# EAGLE design Reverse Geocache schematic v0.0 (EAGLE 5.11)
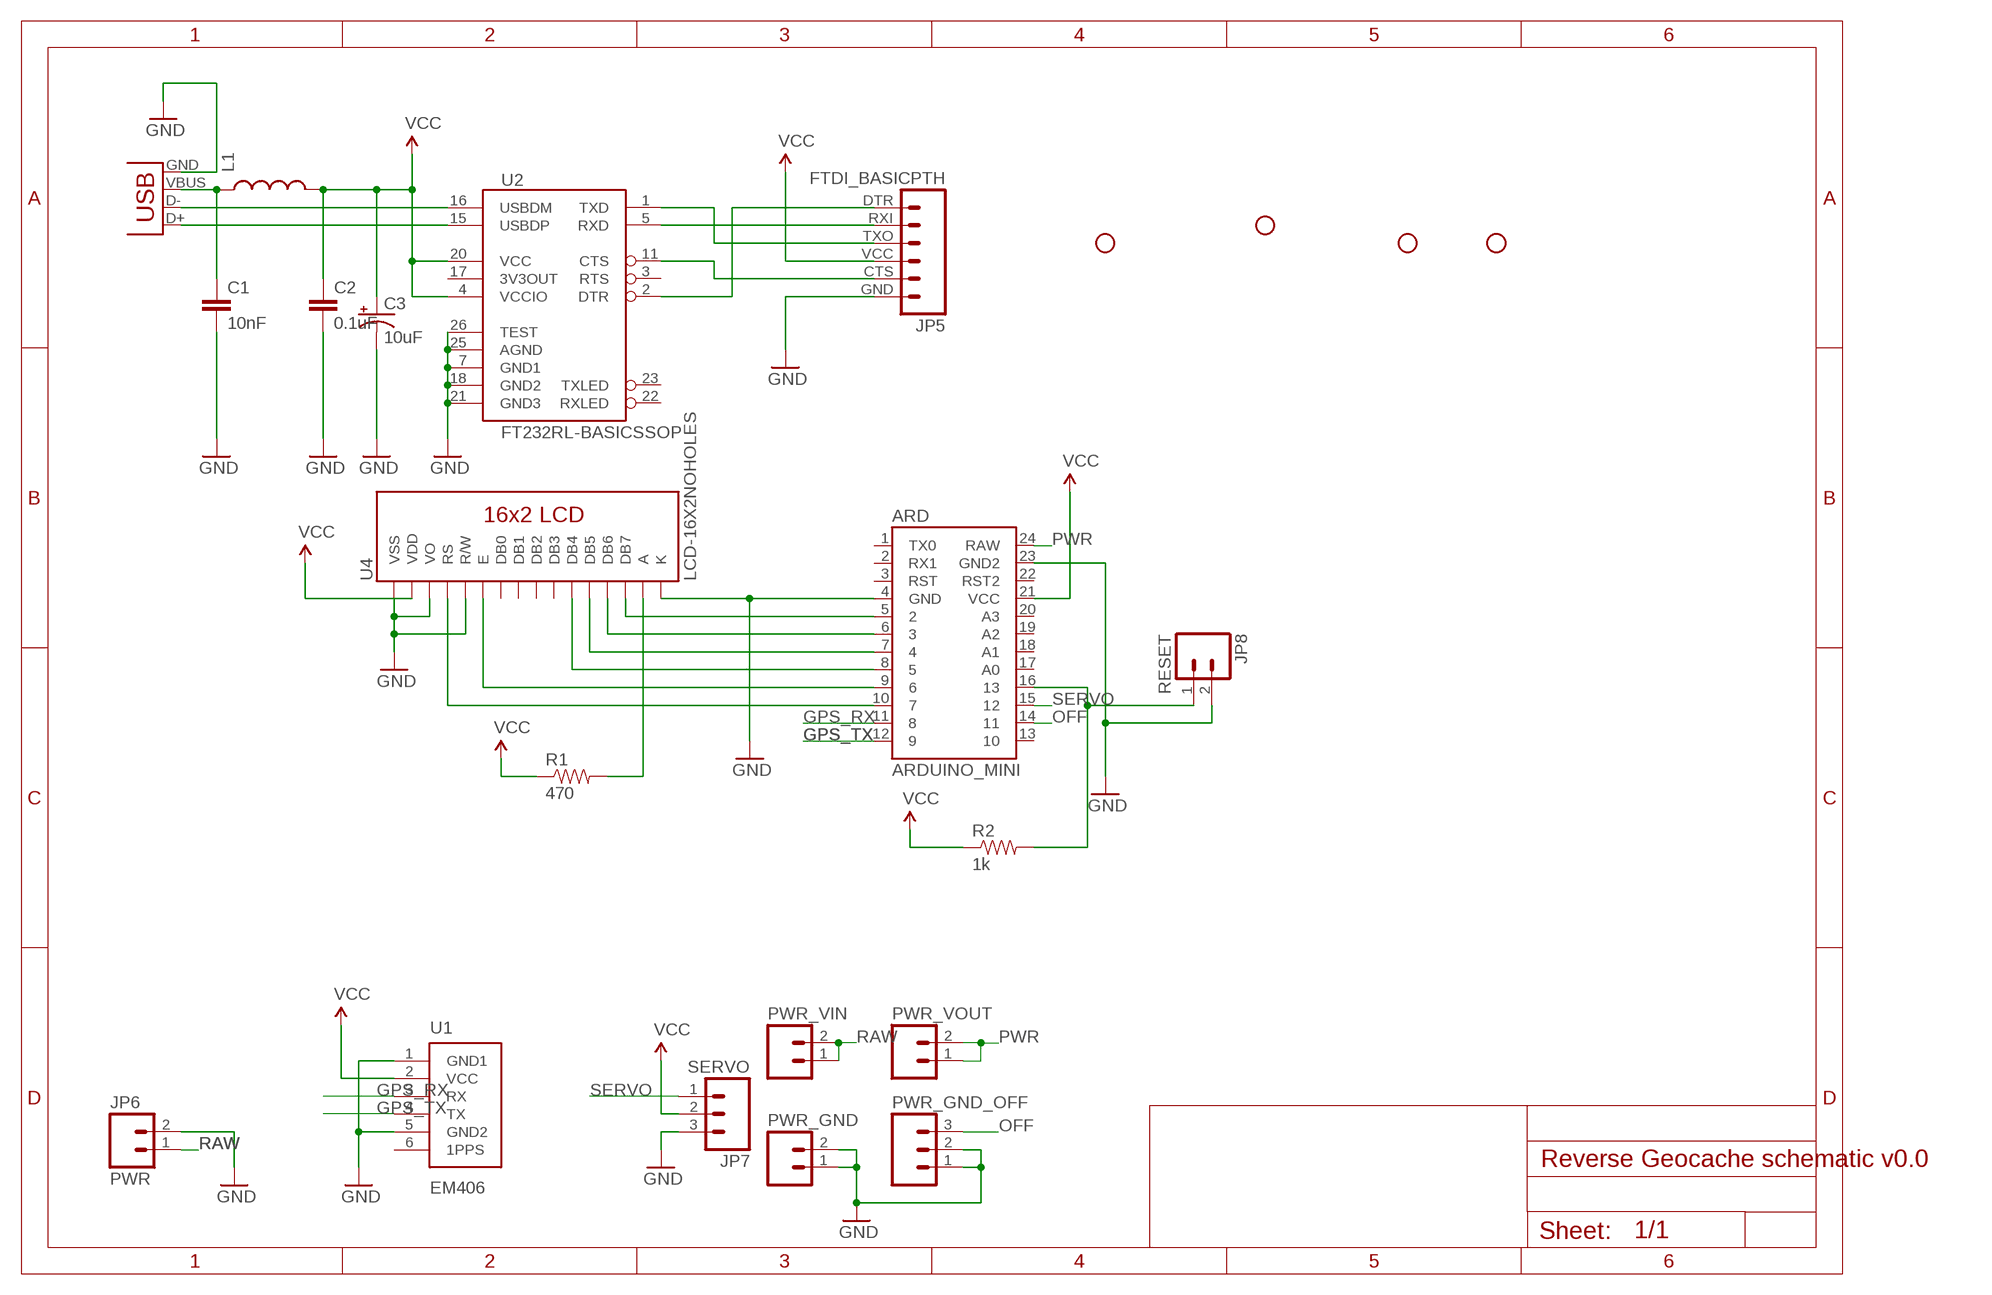
[diagram p0: schematic, sheet 1]

## Parts
ARD  ARDUINO_MINI  [ARDUINO_MINI]
C1  10nF  CAP0603-CAP  [0603-CAP]
C2  0.1uF  CAP0603-CAP  [0603-CAP]
C3  10uF  CAP_POL1206  [EIA3216]
JP1  STAND-OFF  [STAND-OFF]
JP2  STAND-OFF  [STAND-OFF]
JP3  STAND-OFF  [STAND-OFF]
JP4  STAND-OFF  [STAND-OFF]
JP5  FTDI_BASICPTH  [FTDI_BASIC]
JP6  PWR  M02POLAR  [MOLEX-1X2]
JP7  SERVO  M03PTH  [1X03]
JP8  RESET  M02PTH  [1X02]
L1  INDUCTOR0603  [0603]
PWR_GND  M02PTH  [1X02]
PWR_GND_OFF  M03PTH  [1X03]
PWR_VIN  M02PTH  [1X02]
PWR_VOUT  M02PTH  [1X02]
R1  470  RESISTORPTH-1/4W  [AXIAL-0.4]
R2  1k  RESISTORPTH-1/4W  [AXIAL-0.4]
U1  EM406  [EM406]
U2  FT232RL-BASICSSOP  [SSOP28DB]
U4  LCD-16X2NOHOLES  [LCD-16X2_NOHOLES]
X1  USBPTH-VERTICAL  [USB-B-PTH-VERTICAL]

## Nets
GND: ARD.4(GND) ARD.23(GND2) C1.2 C2.2 C3.C(-) JP5.GND JP6.2 JP7.3 JP8.2 PWR_GND.1 PWR_GND.2 PWR_GND_OFF.1 PWR_GND_OFF.2 U1.1(GND1) U1.5(GND2) U2.7(GND1) U2.18(GND2) U2.21(GND3) U2.25(AGND) U2.26(TEST) U4.1(VSS) U4.3(VO) U4.5(R/W) U4.16(K) X1.GND
GPS_RX: ARD.11 U1.3(RX)
GPS_TX: ARD.12 U1.4(TX)
N$1: U2.16(USBDM) X1.D-
N$2: U2.15(USBDP) X1.D+
N$3: C1.1 L1.1 X1.VBUS
N$5: JP5.TXO U2.1(TXD)
N$6: JP5.RXI U2.5(RXD)
N$7: JP5.CTS U2.11(CTS)
N$8: JP5.DTR U2.2(DTR)
N$10: R1.P$2 U4.15(A)
N$11: ARD.16 JP8.1 R2.P$2
N$13: ARD.5 U4.14(DB7)
N$14: ARD.6 U4.13(DB6)
N$15: ARD.7 U4.12(DB5)
N$16: ARD.8 U4.11(DB4)
N$17: ARD.9 U4.6(E)
N$18: ARD.10 U4.4(RS)
OFF: ARD.14 PWR_GND_OFF.3
PWR: ARD.24(RAW) PWR_VOUT.1 PWR_VOUT.2
RAW: JP6.1 PWR_VIN.1 PWR_VIN.2
SERVO: ARD.15 JP7.1
VCC: ARD.21(VCC) C2.1 C3.A(+) JP5.VCC JP7.2 L1.2 R1.P$1 R2.P$1 U1.2(VCC) U2.4(VCCIO) U2.20(VCC) U4.2(VDD)
Unconnected: ARD.1(TX0) ARD.2(RX1) ARD.3(RST) ARD.13 ARD.17(A0) ARD.18(A1) ARD.19(A2) ARD.20(A3) ARD.22(RST2) U1.6(1PPS) U2.3(RTS) U2.17(3V3OUT) U2.22(RXLED) U2.23(TXLED) U4.7(DB0) U4.8(DB1) U4.9(DB2) U4.10(DB3)

## Library data of the parts
ARD = SparkFun:ARDUINO_MINI
C1 C2 = SparkFun:CAP: Capacitor Standard 0603 ceramic capacitor, and 0.1" leaded capacitor.
C3 = SparkFun:CAP_POL: Capacitor Polarized These are standard SMD and PTH capacitors. Normally 10uF, 47uF, and 100uF in electrolytic and tantalum varieties. Always verify the external diameter of the through hole cap, it varies with capacity, voltage, and manufacturer. The EIA devices should be standard.
JP1-JP4 = SparkFun:STAND-OFF: Stand Off This is the mechanical footprint for a #4 phillips button head screw. Use the keepout ring to avoid running the screw head into surrounding components. SKU : PRT-00447
JP5 = SparkFun:FTDI_BASIC: FTDI Basic: 3.3V and 5V
JP6 JP8 PWR_GND PWR_VIN PWR_VOUT = SparkFun:M02: Header 2 Standard 2-pin 0.1" header. Use with straight break away headers (SKU : PRT-00116), right angle break away headers (PRT-00553), swiss pins (PRT-00743), machine pins (PRT-00117), and female headers (PRT-00115). Molex polarized connector foot print use with SKU : PRT-08233 with associated crimp pins and housings.
JP7 PWR_GND_OFF = SparkFun:M03: Header 3 Standard 3-pin 0.1" header. Use with straight break away headers (SKU : PRT-00116), right angle break away headers (PRT-00553), swiss pins (PRT-00743), machine pins (PRT-00117), and female headers (PRT-00115). Molex polarized connector foot print use with SKU : PRT-08232 with associated crimp pins and housings.
L1 = SparkFun:INDUCTOR: Inductors Basic Inductor/Choke - 0603 and 1206. Footprints are not proven and vary greatly between part numbers.
R1 R2 = SparkFun:RESISTOR: Resistor Basic schematic elements and footprints for 0603, 1206, and PTH resistors.
U1 = SparkFun:EM406: EM406 Connector Proven layout and schematic for EM406 connector. Spark Fun Electronics SKU : GPS-00579
U2 = SparkFun:FT232RL-BASIC: USB UART This is the simplified version of the FT232RL unit. Only what you need, nothing you don't. Spark Fun Electronics SKU : COM-00650
U4 = SparkFun:LCD-16X2
X1 = SparkFun:USB: USB Connectors USB-B-PTH is fully proven SKU : PRT-00139 USB-miniB is fully proven SKU : PRT-00587 USB-A-PCB is untested. USB-A-H is throughly reviewed, but untested. Spark Fun Electronics SKU : PRT-00437 USB-B-SMT is throughly reviewed, but untested. Needs silkscreen touching up. USB-A-S has not been used/tested USB-MB-H has not been used/tested

## Board
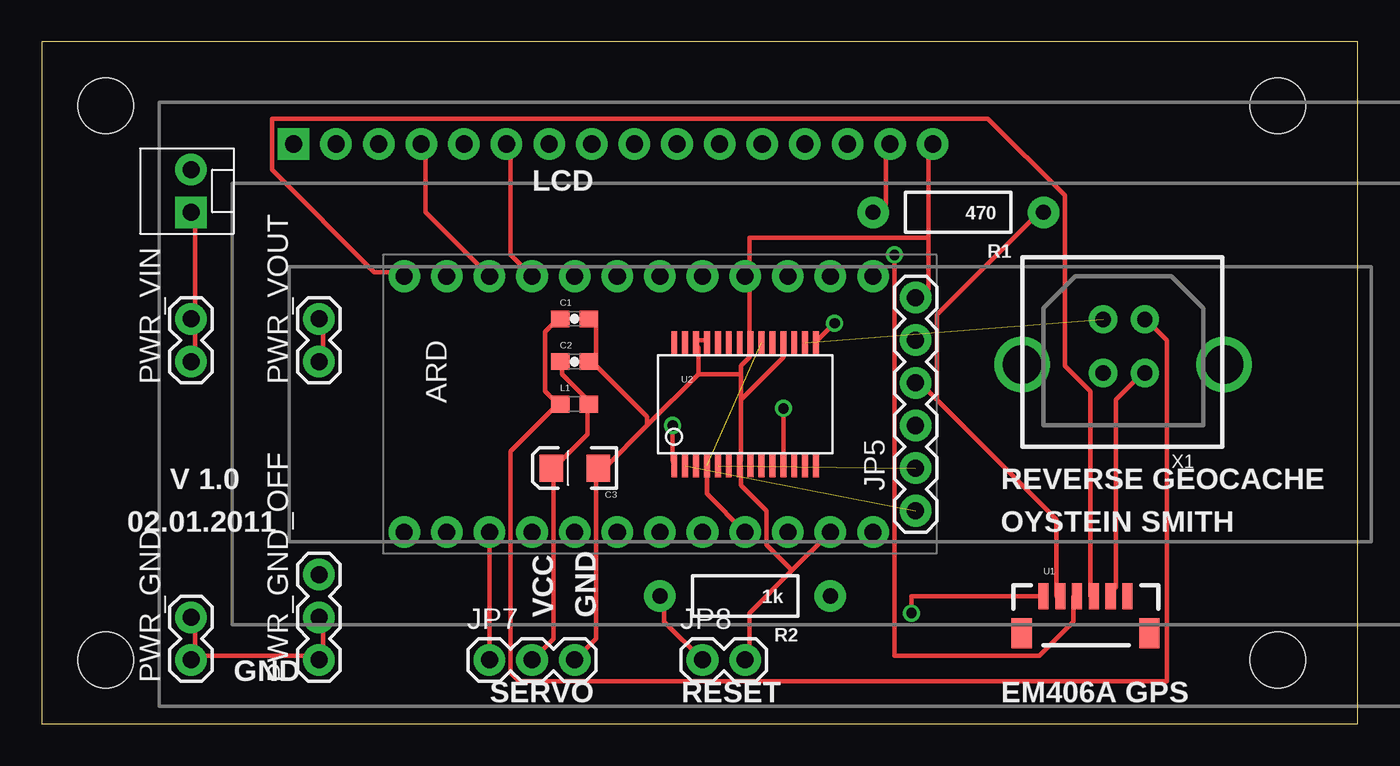
[diagram p1: board, top side]
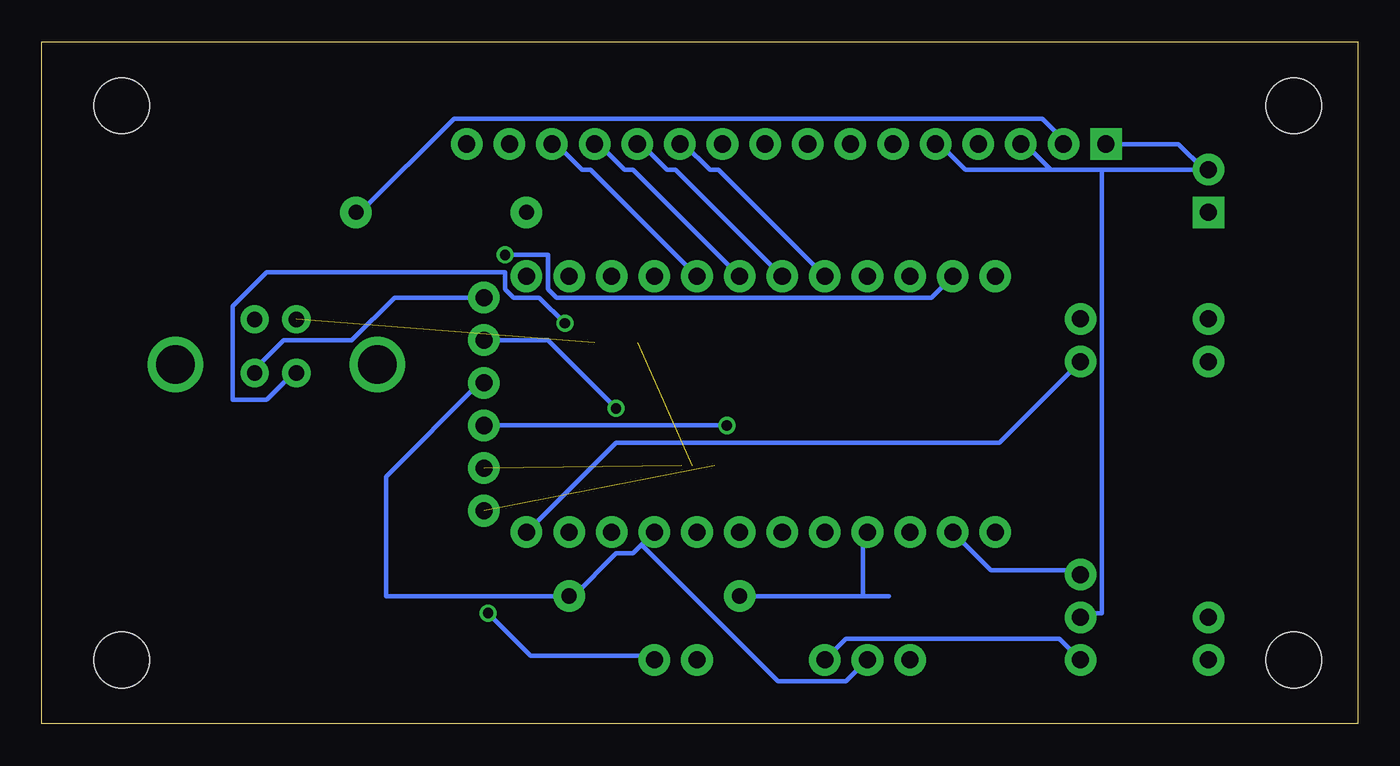
[diagram p2: board, bottom side, seen from below]

Size 78.41 x 40.63 mm. Coordinates in mm from the lower left corner, seen from the top.
Outline: 0,0 78.41,0 78.41,40.63 0,40.63 0,0
Copper layers (1*16): Top 0.035mm / dielectric 1.5mm / Bottom 0.035mm
Design rules "default": minimum track width 10mil, minimum drill 24mil, track to track 8mil, track to pad 8mil, pad to pad 8mil, via to via 8mil, smd to smd 8mil, copper to edge 40mil, drill to drill 8mil, minimum pad ring 10mil, minimum via ring 8mil, stop-mask expansion 4mil, vias tented up to drill 0mil, thermal gap 10mil

### Footprints (pad centres in the part's own frame; a part is rotated, then mirrored left to right if it is on the bottom)
ARDUINO_MINI = drill 1.016 pad 1.88 round: 1 -7.62,12.7; 2 -7.62,10.16; 3 -7.62,7.62; 4 -7.62,5.08; 5 -7.62,2.54; 6 -7.62,0; 7 -7.62,-2.54; 8 -7.62,-5.08; 9 -7.62,-7.62; 10 -7.62,-10.16; 11 -7.62,-12.7; 12 -7.62,-15.24; 13 7.62,-15.24; 14 7.62,-12.7; 15 7.62,-10.16; 16 7.62,-7.62; 17 7.62,-5.08; 18 7.62,-2.54; 19 7.62,0; 20 7.62,2.54; 21 7.62,5.08; 22 7.62,7.62; 23 7.62,10.16; 24 7.62,12.7
0603-CAP = smd 1.1 x 1: 1 -0.85,0; 2 0.85,0
EIA3216 = smd 1.4 x 1.6: A 1.4,0; C -1.4,0
STAND-OFF = hole 3.302: 0,0
FTDI_BASIC = drill 1.016 pad 1.88 round: CTS 10.16,0; DTR 0,0; GND 12.7,0; RXI 2.54,0; TXO 5.08,0; VCC 7.62,0
MOLEX-1X2 = drill 1.016 pad 1.88 square: 1 0,0 | drill 1.016 pad 1.88 round: 2 2.54,0
1X03 = drill 1.016 pad 1.88 round: 1 0,0; 2 2.54,0; 3 5.08,0
1X02 = drill 1.016 pad 1.88 round: 1 0,0; 2 2.54,0
0603 = smd 1.1 x 1: 1 -0.85,0; 2 0.85,0
AXIAL-0.4 = drill 0.9 pad 1.88 round: P$1 -5.08,0; P$2 5.08,0
EM406 = smd 0.6 x 1.55: 1 0,0; 2 1,0; 3 2,0; 4 3,0; 5 4,0; 6 5,0 | smd 1.2 x 1.8: P$1 -1.3,-2.225; P$2 6.3,-2.225
SSOP28DB = smd 0.348 x 1.397: 1 -4.225,-3.656; 2 -3.575,-3.656; 3 -2.925,-3.656; 4 -2.275,-3.656; 5 -1.625,-3.656; 6 -0.975,-3.656; 7 -0.325,-3.656; 8 0.325,-3.656; 9 0.975,-3.656; 10 1.625,-3.656; 11 2.275,-3.656; 12 2.925,-3.656; 13 3.575,-3.656; 14 4.225,-3.656; 15 4.225,3.656; 16 3.575,3.656; 17 2.925,3.656; 18 2.275,3.656; 19 1.625,3.656; 20 0.975,3.656; 21 0.325,3.656; 22 -0.325,3.656; 23 -0.975,3.656; 24 -1.625,3.656; 25 -2.275,3.656; 26 -2.925,3.656; 27 -3.575,3.656; 28 -4.225,3.656
LCD-16X2_NOHOLES = drill 1.016 pad 1.88 square: 1 -32,15.5 | drill 1.016 pad 1.88 round: 2 -29.46,15.5; 3 -26.92,15.5; 4 -24.38,15.5; 5 -21.84,15.5; 6 -19.3,15.5; 7 -16.76,15.5; 8 -14.22,15.5; 9 -11.68,15.5; 10 -9.14,15.5; 11 -6.6,15.5; 12 -4.06,15.5; 13 -1.52,15.5; 14 1.02,15.5; 15 3.56,15.5; 16 6.1,15.5
USB-B-PTH-VERTICAL = drill 0.914 pad 1.676 round: D+ 4.826,4.394; D- 4.826,7.595; GND 7.315,4.394; VBUS 7.315,7.595 | drill 2.286 round: P$1 0,4.902; P$2 12.04,4.902

### Placement (x,y rotation side)
ARD  36.83,19.05 270 top
C1  31.75,24.13 0 top
C2  31.75,21.59 0 top
C3  31.75,15.24 180 top
JP1  3.81,36.83 0 top
JP2  73.66,36.83 0 top
JP3  73.66,3.81 0 top
JP4  3.81,3.81 0 top
JP5  52.07,12.7 90 top
JP6  8.89,30.48 90 top
JP7  26.67,3.81 0 top
JP8  39.37,3.81 0 top
L1  31.75,19.05 0 top
PWR_GND  8.89,3.81 90 top
PWR_GND_OFF  16.51,3.81 90 top
PWR_VIN  8.89,21.59 90 top
PWR_VOUT  16.51,21.59 90 top
R1  54.61,30.48 180 top
R2  41.91,7.62 180 top
U1  59.69,7.62 0 top
U2  41.91,19.05 0 top
U4  46.99,19.05 0 top
X1  58.42,16.51 0 top

### Tracks (layer width: path | path; a pad name or v marks a point on that pad's centre or on a via)
GND  (via drill 0.61)
  Top 0.254: v51.82,6.6 51.82,7.62 U1.1 | 44.7,9.14 42.16,6.6 42.16,4.06 JP8.2 | 44.7,9.14 ARD.23 | U1.5 63.5,7.62 64.01,8.13 64.01,19.3 65.53,20.83 X1.GND | 52.83,28.96 52.83,34.54 U4.16 | 52.83,28.96 52.83,25.91 52.32,25.4 JP5.GND | 9.14,4.06 9.14,6.1 PWR_GND.2 | PWR_GND_OFF.2 16.76,6.1 16.76,4.06 PWR_GND_OFF.1 16.26,4.06 9.14,4.06 | PWR_GND.1 9.14,4.06 | 41.66,20.83 41.66,21.34 42.16,21.84 42.16,22.35 U2.21 42.16,22.86 42.16,26.42 ARD.4 42.16,26.92 42.16,28.96 52.83,28.96 | 41.66,20.83 41.66,19.3 | 41.66,19.3 41.66,15.75 U2.7 41.66,15.24 41.66,14.22 43.18,12.7 43.18,10.67 44.7,9.14 | 41.66,19.3 44.2,21.84 44.2,22.35 U2.18 | C1.2 33.02,23.88 33.02,21.84 C2.2 33.02,21.34 36.07,18.29 36.07,17.78 | U2.25 39.62,22.86 39.12,22.86 U2.26 39.12,22.35 39.12,20.83 | 36.07,17.78 39.12,20.83 | 36.07,17.78 33.53,15.24 C3.C 33.02,15.24 33.02,5.08 JP7.3 | 39.12,20.83 41.66,20.83
  Bottom 0.254: v51.82,6.6 49.28,4.06 42.16,4.06 JP8.2 | 9.14,33.02 10.67,34.54 14.73,34.54 U4.1 | 18.29,33.02 19.81,34.54 U4.3 | 15.24,33.02 9.14,33.02 | 15.24,33.02 18.29,33.02 | 9.14,33.02 JP6.2 | 18.29,33.02 23.37,33.02 24.89,34.54 U4.5 | PWR_GND_OFF.1 17.78,5.08 30.48,5.08 JP7.3 | X1.GND 65.53,21.34 64.01,22.86 59.94,22.86 57.4,25.4 JP5.GND | 15.24,33.02 15.24,6.6 16.26,6.6 PWR_GND_OFF.2
GPS_RX  (via drill 0.61)
  Top 0.254: v50.8,27.94 50.8,4.06 59.44,4.06 61.47,6.1 61.47,7.62 U1.3
  Bottom 0.254: v50.8,27.94 48.26,27.94 48.26,25.91 47.75,25.4 25.4,25.4 ARD.11
GPS_TX
  Top 0.254: U1.4 62.48,7.62 62.48,19.81 60.96,21.34 60.96,31.5 56.39,36.07 13.72,36.07 13.72,33.02 19.81,26.92 21.34,26.92 ARD.12
N$1  (1 unrouted)
N$2  (via drill 0.61)
  Top 0.254: v47.24,23.88 46.23,22.86 U2.15
  Bottom 0.254: v47.24,23.88 48.77,25.4 50.29,25.4 50.8,25.91 50.8,26.92 65.02,26.92 67.06,24.89 67.06,19.3 65.02,19.3 63.5,20.83 X1.D+
N$3
  Top 0.254: C1.1 30.48,23.88 29.97,23.37 29.97,19.81 30.48,19.3 L1.1 30.48,18.8 27.94,16.26 27.94,3.05 28.45,2.54 67.06,2.54 67.06,22.86 66.04,23.88 X1.VBUS
N$5  (via drill 0.61)
  Top 0.254: v37.59,17.78 37.59,15.75 U2.1
  Bottom 0.254: v37.59,17.78 JP5.TXO
N$6  (1 unrouted)
N$7  (via drill 0.61)
  Top 0.254: v44.2,18.8 44.2,15.75 U2.11
  Bottom 0.254: v44.2,18.8 48.26,22.86 JP5.CTS
N$8  (1 unrouted)
N$10
  Top 0.254: R1.P$2 49.78,30.48 50.29,30.99 50.29,34.54 U4.15
N$11
  Top 0.254: JP8.1 37.08,6.1 37.08,7.62 R2.P$2
  Bottom 0.254: 29.46,7.62 27.94,7.62 | 29.46,7.62 R2.P$2 | 29.46,7.62 29.46,11.18 ARD.16
N$13
  Bottom 0.254: ARD.5 45.72,33.02 46.23,33.02 47.75,34.54 U4.14
N$14
  Bottom 0.254: ARD.6 43.18,33.02 43.69,33.02 45.21,34.54 U4.13
N$15
  Bottom 0.254: ARD.7 40.64,33.02 41.15,33.02 42.67,34.54 U4.12
N$16
  Bottom 0.254: ARD.8 38.1,33.02 38.61,33.02 40.13,34.54 U4.11
N$17
  Top 0.254: ARD.9 27.94,27.94 27.94,34.54 U4.6
N$18
  Top 0.254: ARD.10 22.86,30.48 22.86,34.54 U4.4
OFF
  Bottom 0.254: ARD.14 21.84,9.14 16.76,9.14 PWR_GND_OFF.3
PWR
  Top 0.254: PWR_VOUT.1 16.76,21.84 16.76,23.88 PWR_VOUT.2
  Bottom 0.254: ARD.24 44.2,16.76 21.34,16.76 PWR_VOUT.1
RAW
  Top 0.254: PWR_VIN.1 9.14,21.84 9.14,23.88 PWR_VIN.2 9.14,24.38 9.14,30.48 JP6.1
SERVO
  Top 0.254: JP7.1 ARD.15
VCC  (1 unrouted)
  Top 0.254: 53.34,19.3 52.32,20.32 JP5.VCC | 53.34,19.3 60.45,12.19 60.45,7.62 U1.2 | 53.34,19.3 53.34,24.38 59.44,30.48 R1.P$1 | U2.4 39.62,15.24 39.62,13.72 ARD.21 | C2.1 30.99,21.34 30.99,20.83 32.51,19.3 L1.2 32.51,18.8 32.51,17.27 30.48,15.24 | 30.48,15.24 30.48,5.08 JP7.2 | 30.48,15.24 C3.A
  Bottom 0.254: 42.67,10.67 43.18,10.16 44.2,10.16 46.74,7.62 R2.P$1 57.91,7.62 57.91,14.73 52.32,20.32 JP5.VCC | 42.67,10.67 ARD.21 | 42.67,10.67 34.54,2.54 30.48,2.54 JP7.2 | U4.2 17.78,35.05 18.8,36.07 53.85,36.07 59.44,30.48 R1.P$1

### Text on the board
tPlace: LCD | V 1.0 | REVERSE GEOCACHE | 02.01.2011 | OYSTEIN SMITH | VCC | GND | GND | SERVO | RESET | EM406A GPS